# Altium schematic sheet CPBCC.SchDoc
size A4
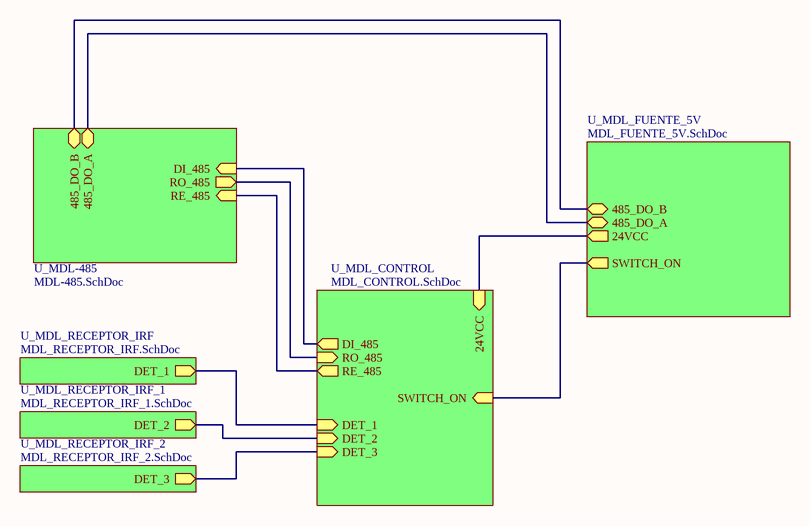
[diagram p0: CPBCC.SchDoc]

## Sub-sheets
U_MDL-485 = MDL-485.SchDoc: RO_485 (out), RE_485 (in), DI_485 (in), 485_DO_B (bidir), 485_DO_A (bidir)
U_MDL_CONTROL = MDL_CONTROL.SchDoc: DI_485 (out), RO_485 (in), RE_485 (out), DET_1 (in), DET_2 (in), DET_3 (in), 24VCC (in), SWITCH_ON (in)
U_MDL_FUENTE_5V = MDL_FUENTE_5V.SchDoc: 485_DO_A, SWITCH_ON (out), 485_DO_B, 24VCC (out)
U_MDL_RECEPTOR_IRF = MDL_RECEPTOR_IRF.SchDoc: DET_1 (out)
U_MDL_RECEPTOR_IRF_1 = MDL_RECEPTOR_IRF_1.SchDoc: DET_2 (out)
U_MDL_RECEPTOR_IRF_2 = MDL_RECEPTOR_IRF_2.SchDoc: DET_3 (out)

## Nets
(unnamed): sheet U_MDL_CONTROL/DI_485, sheet U_MDL-485/DI_485
(unnamed): sheet U_MDL_CONTROL/RO_485, sheet U_MDL-485/RO_485
(unnamed): sheet U_MDL_CONTROL/RE_485, sheet U_MDL-485/RE_485
(unnamed): sheet U_MDL_CONTROL/DET_1, sheet U_MDL_RECEPTOR_IRF/DET_1
(unnamed): sheet U_MDL_CONTROL/DET_2, sheet U_MDL_RECEPTOR_IRF_1/DET_2
(unnamed): sheet U_MDL_CONTROL/DET_3, sheet U_MDL_RECEPTOR_IRF_2/DET_3
(unnamed): sheet U_MDL_CONTROL/24VCC, sheet U_MDL_FUENTE_5V/24VCC
(unnamed): sheet U_MDL_CONTROL/SWITCH_ON, sheet U_MDL_FUENTE_5V/SWITCH_ON
(unnamed): sheet U_MDL-485/485_DO_B, sheet U_MDL_FUENTE_5V/485_DO_B
(unnamed): sheet U_MDL-485/485_DO_A, sheet U_MDL_FUENTE_5V/485_DO_A